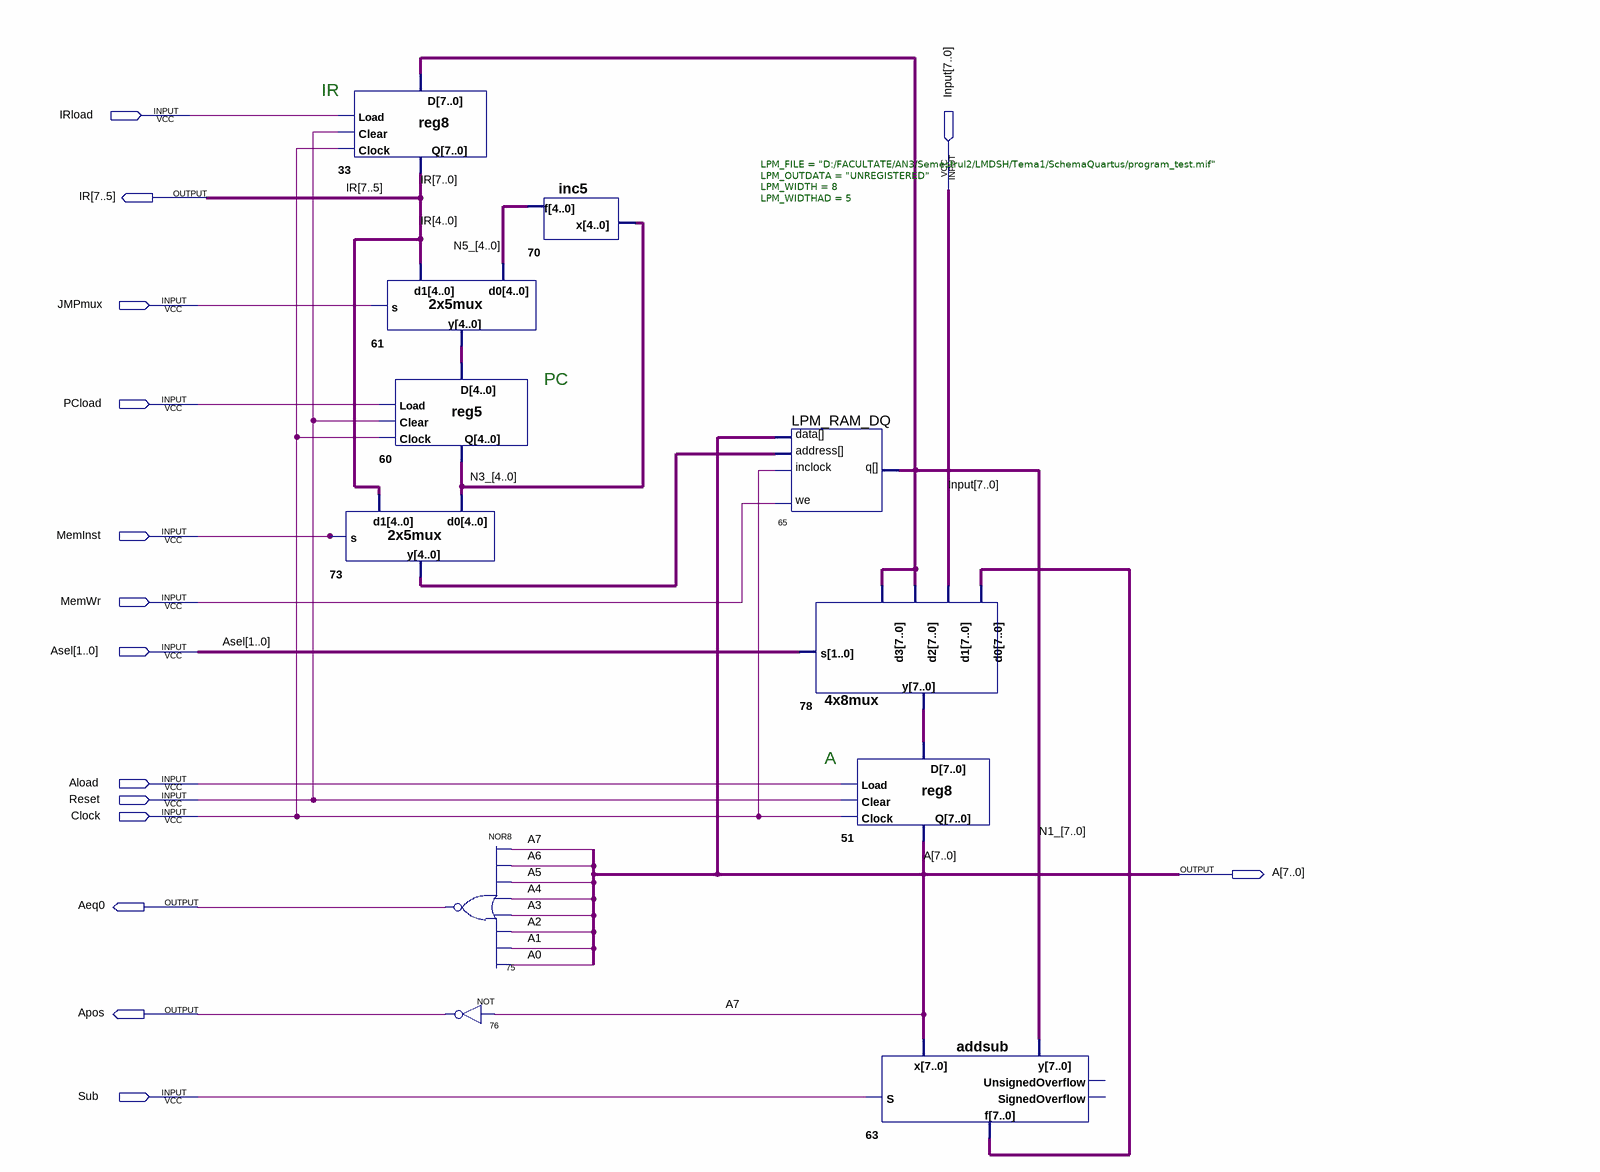
[diagram p0: schematic sheet]
// Quartus schematic dp.bdf as structural Verilog: 11 symbols, 15 pins
module dp (
  input  IRload,
  input  [7:0] Input,
  input  JMPmux,
  input  PCload,
  input  MemInst,
  input  MemWr,
  input  [1:0] Asel,
  input  Aload,
  input  Reset,
  input  Clock,
  input  Sub,
  output [7:0] IR,
  output [7:0] A,
  output Aeq0,
  output Apos
);

  wire [4:0] N3_, N5_, n61_y, n73_y;
  wire [7:0] N1_, n63_f, n78_y;

  reg8 u_33 (.Load(IRload), .Clear(Reset), .Clock(Clock), .D(N1_), .Q(IR));
  \2x5mux  u_73 (.s(MemInst), .d0(N3_), .d1(IR[4:0]), .y(n73_y));
  \2x5mux  u_61 (.s(JMPmux), .d0(N5_), .d1(IR[4:0]), .y(n61_y));
  reg5 u_60 (.Load(PCload), .Clear(Reset), .Clock(Clock), .D(n61_y), .Q(N3_));
  nor u_75 (Aeq0, A[7], A[6], A[5], A[4], A[3], A[2], A[1], A[0]);
  not u_76 (Apos, A[7]);
  inc5 u_70 (.x(N3_), .f(N5_));
  LPM_RAM_DQ #(.LPM_FILE("D:/FACULTATE/AN3/Semestrul2/LMDSH/Tema1/SchemaQuartus/program_test.mif"), .LPM_OUTDATA("UNREGISTERED"), .LPM_WIDTH(8), .LPM_WIDTHAD(5)) u_65 (
    .inclock(Clock), .data(A), .address(n73_y), .we(MemWr), .q(N1_));
  \4x8mux  u_78 (.d3(N1_), .d2(N1_), .d1(Input), .d0(n63_f), .s(Asel), .y(n78_y));
  reg8 u_51 (.Load(Aload), .Clear(Reset), .Clock(Clock), .D(n78_y), .Q(A));
  addsub u_63 (.S(Sub), .y(N1_), .x(A), .f(n63_f));  // open: UnsignedOverflow, SignedOverflow

  // Notes on the sheet:
  //   IR
  //   PC
  //   A
endmodule
